# EAGLE design FISHFEEDER (EAGLE 9.2.2)
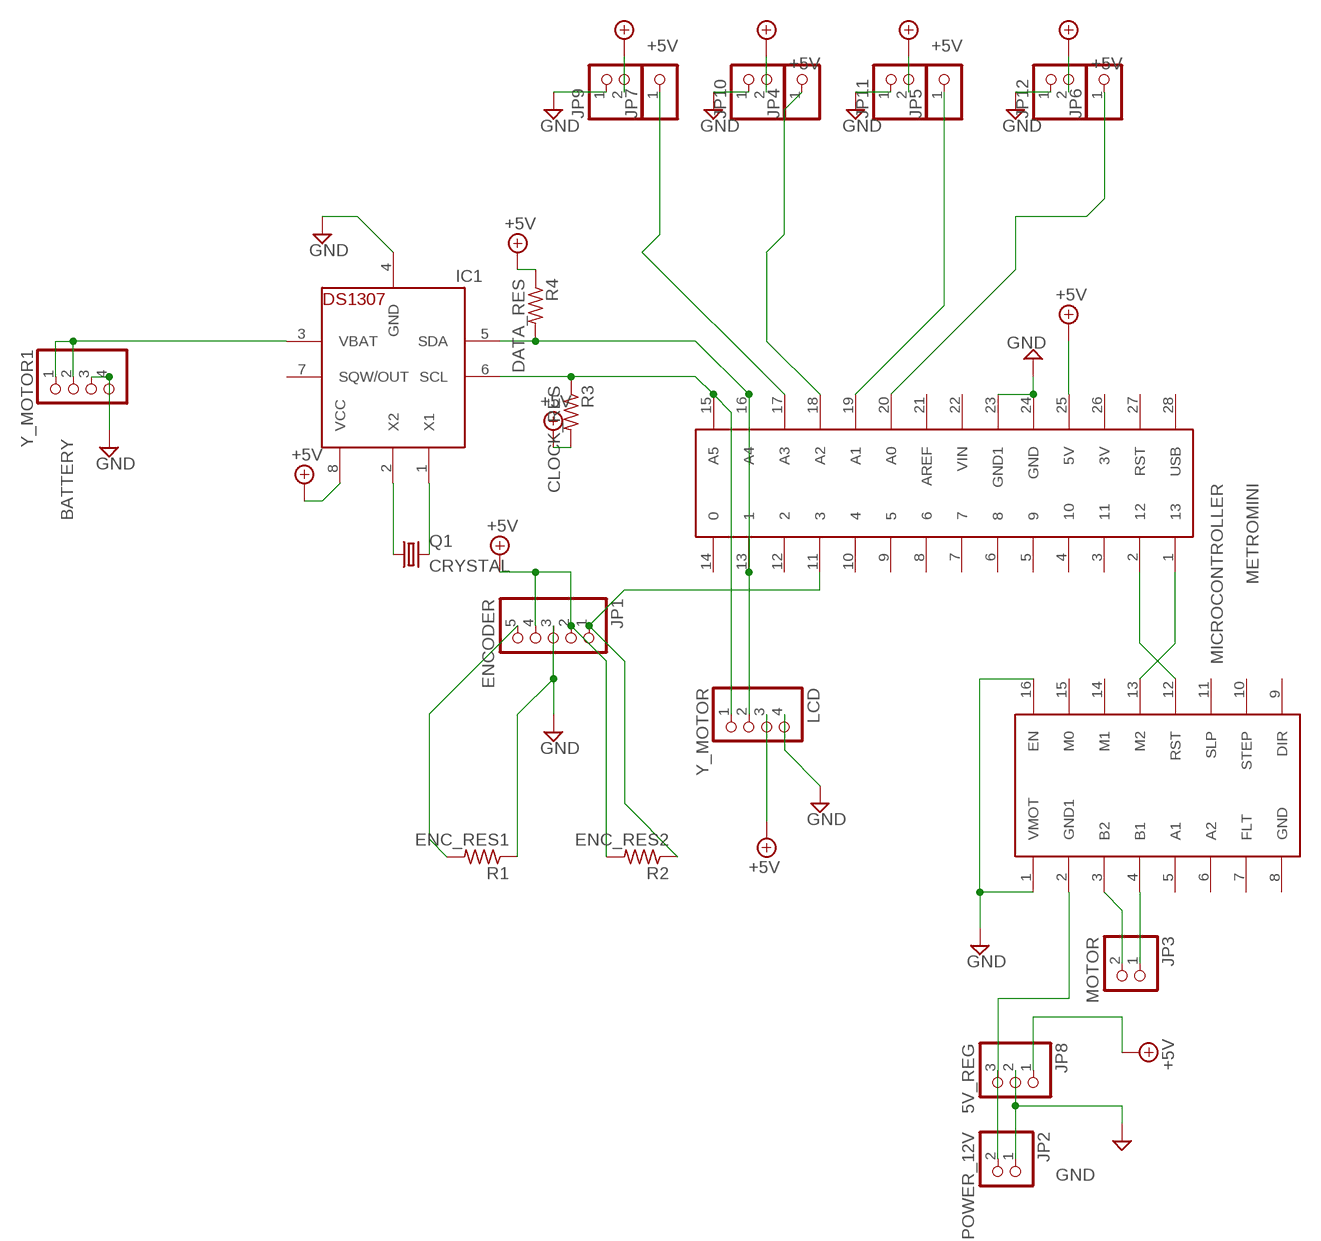
[diagram p0: schematic, sheet 1]

## Parts
IC1  CLOCK_CHIP  DS1307  [DIL08]
JP1  ENCODER  PINHD-1X5  [1X05]
JP2  POWER_12V  PINHD-1X2  [1X02]
JP3  MOTOR  PINHD-1X2  [1X02]
JP4  PINHD-1X1CB  [1X01-CLEANBIG]
JP5  PINHD-1X1CB  [1X01-CLEANBIG]
JP6  PINHD-1X1CB  [1X01-CLEANBIG]
JP7  PINHD-1X1CB  [1X01-CLEANBIG]
JP8  5V_REG  PINHD-1X3  [1X03]
JP9  PINHD-1X2  [1X02]
JP10  PINHD-1X2  [1X02]
JP11  PINHD-1X2  [1X02]
JP12  PINHD-1X2  [1X02]
MICROCONTROLLER  METROMINI  [METROMINI]
Q1  CRYSTAL  CRYSTALTC26H  [TC26H]
R1  ENC_RES1  R-US_0204/7  [0204/7]
R2  ENC_RES2  R-US_0204/7  [0204/7]
R3  CLOCK_RES  R-US_0204/7  [0204/7]
R4  DATA_RES  R-US_0204/7  [0204/7]
U$1  DRV8825  [DRV8825]
Y_MOTOR  LCD  PINHD-1X4  [1X04]
Y_MOTOR1  BATTERY  PINHD-1X4  [1X04]

## Nets
12V: JP2.2 JP8.3 U$1.2(GND1)
+5V [power]: IC1.8(VCC) JP1.2 JP1.4 JP8.1 JP9.2 JP10.2 JP11.2 JP12.2 MICROCONTROLLER.25(5V) R2.2 R3.2 R4.1 Y_MOTOR.3
ENC_DATA: JP1.1 MICROCONTROLLER.11 R2.1
GND [gnd]: IC1.4(GND) JP1.3 JP2.1 JP8.2 JP9.1 JP10.1 JP11.1 JP12.1 MICROCONTROLLER.23(GND1) MICROCONTROLLER.24(GND) R1.1 U$1.1(VMOT) U$1.16(EN) Y_MOTOR1.3 Y_MOTOR1.4 Y_MOTOR.4
N$1: IC1.5(SDA) MICROCONTROLLER.13 MICROCONTROLLER.16(A4) R4.2 Y_MOTOR.2
N$2: IC1.6(SCL) MICROCONTROLLER.15(A5) R3.1 Y_MOTOR.1
N$3: IC1.2(X2) Q1.1
N$4: IC1.1(X1) Q1.2
N$5: IC1.3(VBAT) Y_MOTOR1.1 Y_MOTOR1.2
N$8: MICROCONTROLLER.2 U$1.12(RST)
N$9: JP6.1 MICROCONTROLLER.20(A0)
N$10: JP5.1 MICROCONTROLLER.19(A1)
N$11: JP4.1 MICROCONTROLLER.18(A2)
N$12: JP7.1 MICROCONTROLLER.17(A3)
N$13: JP1.5 R1.2
N$14: MICROCONTROLLER.1 U$1.13(M2)
N$16: JP3.2 U$1.3(B2)
N$17: JP3.1 U$1.4(B1)
Unconnected: IC1.7(SQW/OUT) MICROCONTROLLER.3 MICROCONTROLLER.4 MICROCONTROLLER.5 MICROCONTROLLER.6 MICROCONTROLLER.7 MICROCONTROLLER.8 MICROCONTROLLER.9 MICROCONTROLLER.10 MICROCONTROLLER.12 MICROCONTROLLER.14 MICROCONTROLLER.21(AREF) MICROCONTROLLER.22(VIN) MICROCONTROLLER.26(3V) MICROCONTROLLER.27(RST) MICROCONTROLLER.28(USB) U$1.5(A1) U$1.6(A2) U$1.7(FLT) U$1.8(GND) U$1.9(DIR) U$1.10(STEP) U$1.11(SLP) U$1.14(M1) U$1.15(M0)

## Library data of the parts
IC1 = adafruit:DS1307: DS1307 Real time clock (RTC) with battery backup ability. Talk to it via i2c
JP1 = pinhead:PINHD-1X5: PIN HEADER
JP2 JP3 JP9-JP12 = pinhead:PINHD-1X2: PIN HEADER
JP4-JP7 = adafruit:PINHD-1X1: Pin header 1x1 for 0.1" spacing With round pins
JP8 = adafruit:PINHD-1X3: PIN HEADER
MICROCONTROLLER = julian:METROMINI
Q1 = adafruit:CRYSTAL: CRYSTAL; OC_FARNELL: unknown; OC_NEWARK: unknown
R1-R4 = adafruit:R-US_: RESISTOR, American symbol
U$1 = julian:DRV8825
Y_MOTOR Y_MOTOR1 = pinhead:PINHD-1X4: PIN HEADER

## Net classes
0 default: width 0.457 mm, drill 0.457 mm, clearance 0.457 mm
1 power: width 0.457 mm, drill 0.457 mm, clearance 0.457 mm
2 gnd: width 0.457 mm, drill 0.457 mm, clearance 0.457 mm
3 usbvcc: width 0.457 mm, drill 0.457 mm, clearance 0.457 mm
4 aref: width 0.254 mm, drill 0.457 mm, clearance 0.457 mm

## Board
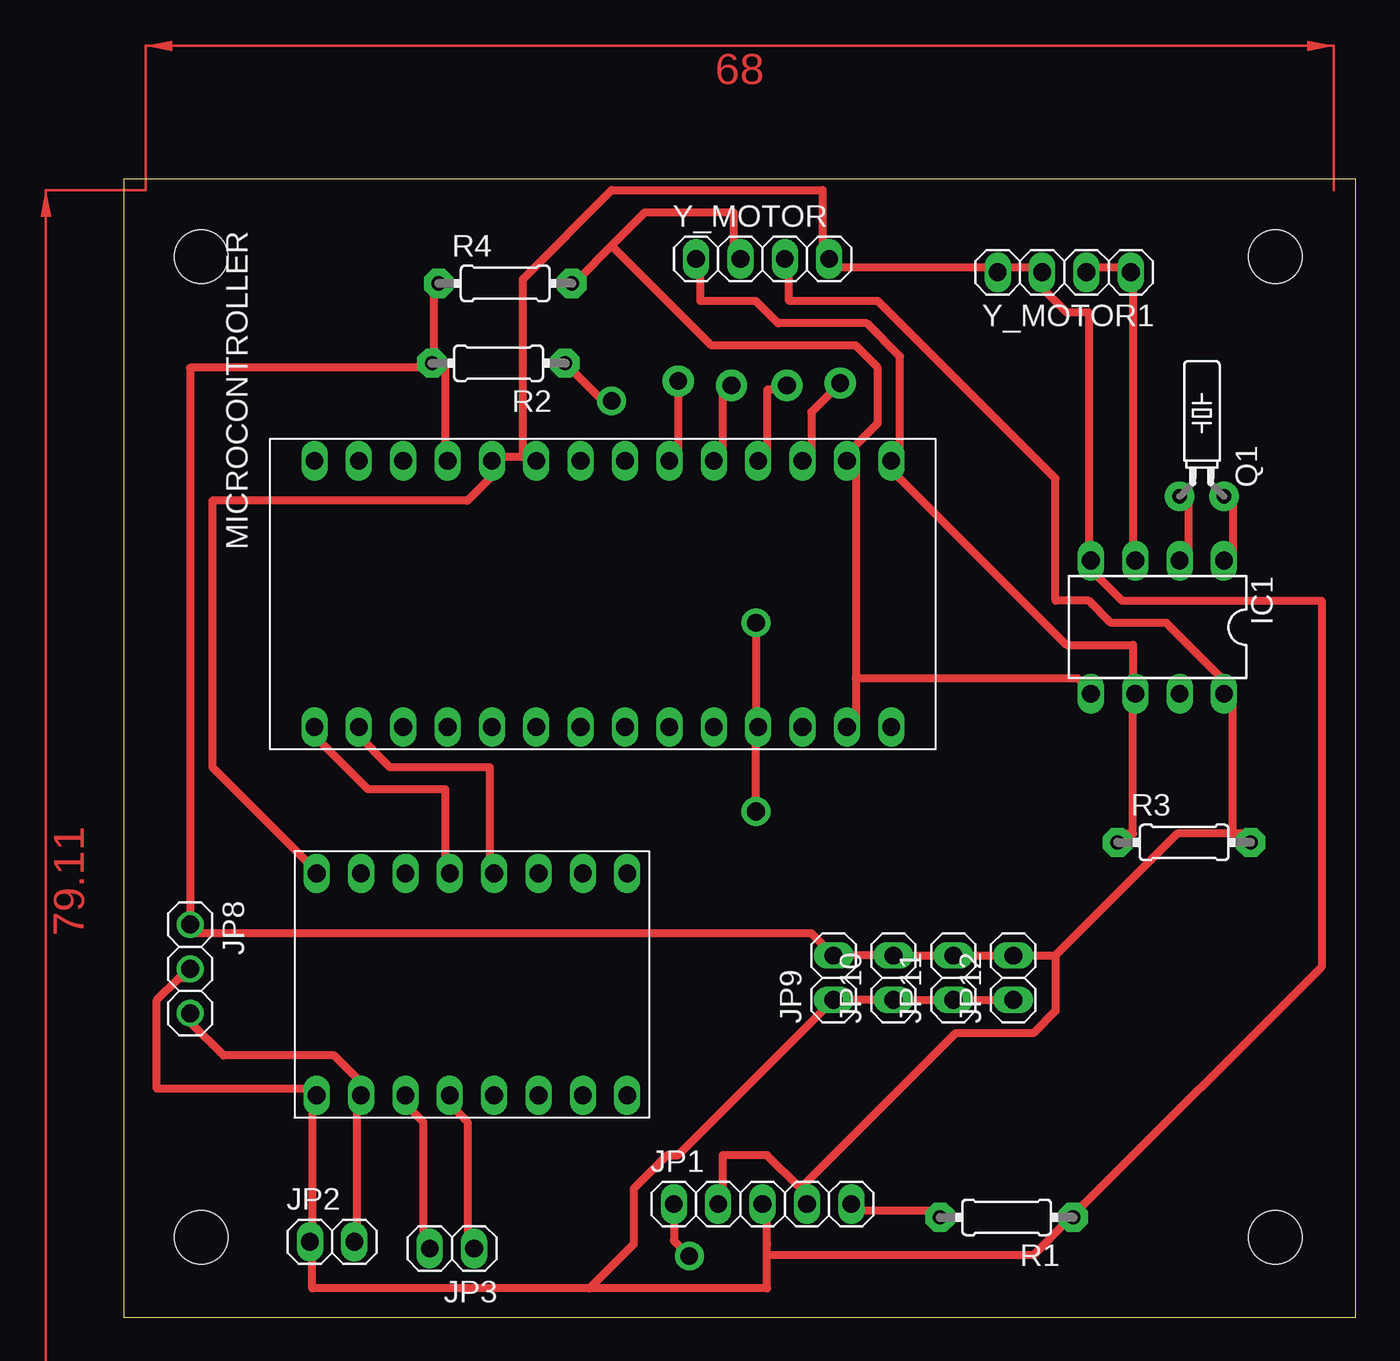
[diagram p1: board, top side]
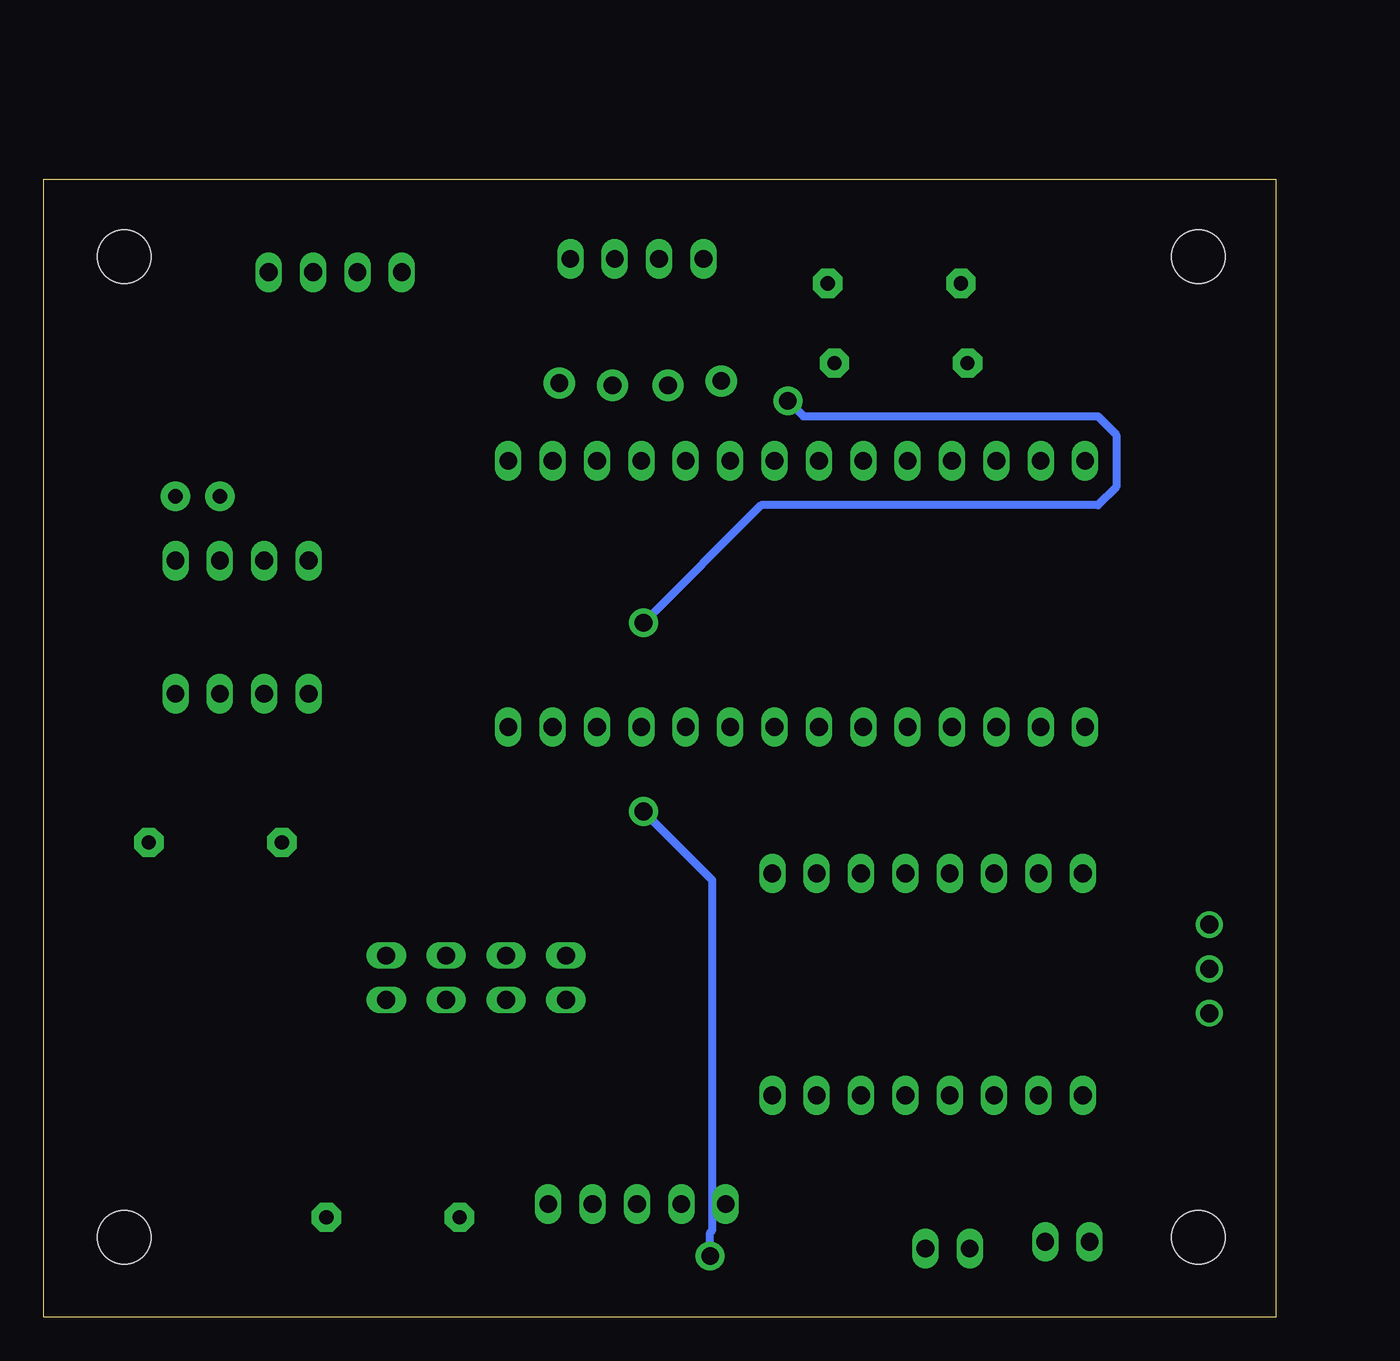
[diagram p2: board, bottom side, seen from below]

Size 70.54 x 65.14 mm. Coordinates in mm from the lower left corner, seen from the top.
Outline: 0,0 70.54,0 70.54,65.14 0,65.14 0,0
Copper layers (1*16): Top 0.035mm / dielectric 1.5mm / Bottom 0.035mm
Design rules "OthermillDRC_1_32_v2": minimum track width 8mil, minimum drill 0.8mm, track to track 0.794003125mm, track to pad 0.794003125mm, pad to pad 0.794003125mm, via to via 0.794003125mm, smd to smd 0mil, copper to edge 0mil, drill to drill 1mil, minimum pad ring 10mil, minimum via ring 10mil, stop-mask expansion 1mil, vias tented up to drill 30mil, thermal gap 10mil
Holes 3.05 mm at 4.45,60.71 65.91,60.71 4.45,4.57 65.91,4.57

### Footprints (pad centres in the part's own frame; a part is rotated, then mirrored left to right if it is on the bottom)
DIL08 = drill 1.016 long: 1 -3.81,-3.81; 2 -1.27,-3.81; 3 1.27,-3.81; 4 3.81,-3.81; 5 3.81,3.81; 6 1.27,3.81; 7 -1.27,3.81; 8 -3.81,3.81
1X05 = drill 1.016 long: 1 -5.08,0; 2 -2.54,0; 3 0,0; 4 2.54,0; 5 5.08,0
1X02 = drill 1.016 long: 1 -1.27,0; 2 1.27,0
1X01-CLEANBIG = drill 1.016 pad 1.778: 1 0,0
1X03 = drill 1.016: 1 -2.54,0; 2 0,0; 3 2.54,0
METROMINI = drill 1.016 long: 1 -16.51,-3.81; 2 -13.97,-3.81; 3 -11.43,-3.81; 4 -8.89,-3.81; 5 -6.35,-3.81; 6 -3.81,-3.81; 7 -1.27,-3.81; 8 1.27,-3.81; 9 3.81,-3.81; 10 6.35,-3.81; 11 8.89,-3.81; 12 11.43,-3.81; 13 13.97,-3.81; 14 16.51,-3.81; 15 16.51,11.43; 16 13.97,11.43; 17 11.43,11.43; 18 8.89,11.43; 19 6.35,11.43; 20 3.81,11.43; 21 1.27,11.43; 22 -1.27,11.43; 23 -3.81,11.43; 24 -6.35,11.43; 25 -8.89,11.43; 26 -11.43,11.43; 27 -13.97,11.43; 28 -16.51,11.43
TC26H = drill 0.813 pad 1.676: 1 -1.27,0; 2 1.27,0
0204/7 = drill 0.813 pad 1.676 octagon: 1 -3.81,0; 2 3.81,0
DRV8825 = drill 1.016 long: 1 -7.62,-1.27; 2 -5.08,-1.27; 3 -2.54,-1.27; 4 0,-1.27; 5 2.54,-1.27; 6 5.08,-1.27; 7 7.62,-1.27; 8 10.16,-1.27; 9 10.16,11.43; 10 7.62,11.43; 11 5.08,11.43; 12 2.54,11.43; 13 0,11.43; 14 -2.54,11.43; 15 -5.08,11.43; 16 -7.62,11.43
1X04 = drill 1.016 long: 1 -3.81,0; 2 -1.27,0; 3 1.27,0; 4 3.81,0

### Placement (x,y rotation side)
IC1  59.18,39.5 180 top
JP1  36.58,6.48 0 top
JP2  11.94,4.32 0 top
JP3  18.8,3.94 180 top
JP4  37.97,53.34 90 top
JP5  34.8,53.34 90 top
JP6  31.75,53.59 0 top
JP7  41.02,53.47 0 top
JP8  3.81,19.94 270 top
JP9  40.64,19.43 90 top
JP10  44.07,19.43 90 top
JP11  47.5,19.43 90 top
JP12  50.93,19.43 90 top
MICROCONTROLLER  27.43,37.59 0 top
Q1  61.72,46.99 0 top
R1  50.55,5.71 180 top
R2  21.46,54.61 180 top
R3  60.71,27.18 0 top
R4  21.84,59.18 0 top
U$1  18.67,13.97 0 top
Y_MOTOR  36.58,60.58 0 top
Y_MOTOR1  53.85,59.82 180 top

### Tracks (layer width: path | path; a pad name or v marks a point on that pad's centre or on a via)
12V
  Top 0.457: JP2.2 13.33,4.83 13.33,12.45 U$1.2 13.97,13.08 12.06,14.99 5.71,14.99 3.81,16.89 JP8.3
+5V
  Top 0.457: R2.2 17.14,54.36 3.81,54.36 JP8.1 3.81,21.97 39.37,21.97 JP9.2 JP10.2 JP11.2 JP12.2 53.34,20.7 | MICROCONTROLLER.25 18.42,49.28 18.42,54.36 17.78,54.36 R2.2 | R4.1 17.78,58.8 17.78,54.99 R2.2 | 38.73,7.37 39.37,6.73 JP1.4 38.73,7.37 | 38.73,7.37 36.83,9.27 34.29,9.27 34.29,6.73 JP1.2 | 38.73,7.37 47.62,16.26 52.07,16.26 53.34,17.53 53.34,20.7 | 63.5,27.69 63.5,35.31 IC1.8 63.5,35.94 59.69,39.75 56.52,39.75 55.25,41.02 53.34,41.02 53.34,48.01 43.18,58.17 38.1,58.17 38.1,60.07 Y_MOTOR.3 | 63.5,27.69 64.13,27.69 R3.2 | 53.34,20.7 60.33,27.69 63.5,27.69
ENC_DATA  (via drill 1.02 pad 1.65)
  Top 0.457: JP1.1 31.5,4.39 v32.38,3.5 | v36.2,28.96 36.2,33.66 | 36.2,33.66 MICROCONTROLLER.11 36.2,33.91 | R2.1 27.43,52.45 v27.94,52.45 | v36.2,39.75 36.2,34.04 36.2,33.91 | 36.2,33.91 36.2,33.66
  Bottom 0.457: v32.38,3.5 32.38,4.84 32.25,4.98 32.25,25.01 v36.2,28.96 | v36.2,39.75 29.47,46.47 10.18,46.47 9.14,47.52 9.14,50.52 10.18,51.57 27.06,51.57 v27.94,52.45
GND
  Top 0.457: JP8.2 3.81,19.43 3.17,19.43 1.91,18.16 1.91,13.08 10.79,13.08 U$1.1 10.79,12.45 10.79,4.83 JP2.1 10.79,4.19 10.79,1.65 26.67,1.65 | JP12.1 JP11.1 JP10.1 JP9.1 31.75,9.27 31.12,9.27 29.21,7.37 29.21,4.19 26.67,1.65 | 36.83,3.56 36.83,4.19 36.83,6.1 JP1.3 | 36.83,3.56 36.83,1.65 26.67,1.65 | 36.83,3.56 52.07,3.56 53.98,5.46 R1.1 54.61,6.1 68.58,20.07 68.58,41.02 57.15,41.02 55.25,42.93 IC1.4 55.25,43.56 55.25,57.53 53.98,57.53 52.07,59.44 Y_MOTOR1.3 52.07,60.07 50.16,60.07 Y_MOTOR1.4 49.53,60.07 40.64,60.07 Y_MOTOR.4 40.01,60.71 40.01,64.52 27.94,64.52 22.86,59.44 22.86,49.28 | U$1.16 10.79,25.78 5.08,31.5 5.08,46.74 19.69,46.74 21.59,48.64 MICROCONTROLLER.24 21.59,49.28 22.86,49.28 | 22.86,49.28 23.5,49.28 MICROCONTROLLER.23
N$1
  Top 0.457: 27.94,61.34 26.04,59.44 R4.2 | 27.94,61.34 29.85,63.25 34.93,63.25 34.93,60.71 Y_MOTOR.2 | 41.91,36.58 41.91,48.64 MICROCONTROLLER.16 41.27,49.28 43.18,51.18 43.18,54.36 41.91,55.63 33.66,55.63 27.94,61.34 | 41.91,36.58 41.91,34.04 MICROCONTROLLER.13 | 41.91,36.58 54.61,36.58 55.25,35.94 IC1.5
N$2
  Top 0.457: R3.1 57.15,27.69 57.79,27.69 57.79,35.31 IC1.6 57.79,35.94 57.79,38.48 53.98,38.48 43.81,48.64 MICROCONTROLLER.15 44.45,49.28 44.45,54.99 42.55,56.9 37.47,56.9 36.2,58.17 33.02,58.17 33.02,60.07 Y_MOTOR.1
N$3
  Top 0.457: IC1.2 60.96,43.56 60.96,46.74 Q1.1
N$4
  Top 0.457: IC1.1 63.5,43.56 63.5,46.74 Q1.2
N$5
  Top 0.457: IC1.3 57.79,43.56 57.79,59.44 Y_MOTOR1.1 57.15,60.07 55.25,60.07 Y_MOTOR1.2
N$8
  Top 0.457: U$1.12 20.96,25.78 20.96,31.5 15.24,31.5 13.33,33.4 MICROCONTROLLER.2
N$9
  Top 0.457: JP6.1 31.75,49.28 MICROCONTROLLER.20
N$10
  Top 0.457: MICROCONTROLLER.19 34.29,49.28 34.29,53.09 JP5.1
N$11
  Top 0.457: MICROCONTROLLER.18 36.83,49.28 36.83,53.09 37.47,53.09 JP4.1
N$12
  Top 0.457: JP7.1 39.37,51.82 39.37,49.28 MICROCONTROLLER.17
N$13
  Top 0.457: JP1.5 41.91,6.1 46.36,6.1 R1.2
N$14
  Top 0.457: U$1.13 18.42,25.78 18.42,30.23 13.97,30.23 10.79,33.4 MICROCONTROLLER.1
N$16
  Top 0.457: JP3.2 17.14,4.19 17.14,11.18 15.88,12.45 U$1.3
N$17
  Top 0.457: JP3.1 19.69,4.19 19.69,11.18 18.42,12.45 U$1.4
(copper drawn outside any net)
  shapes: Top area x2